# EAGLE design preScale-Mb501 (EAGLE 5.07)
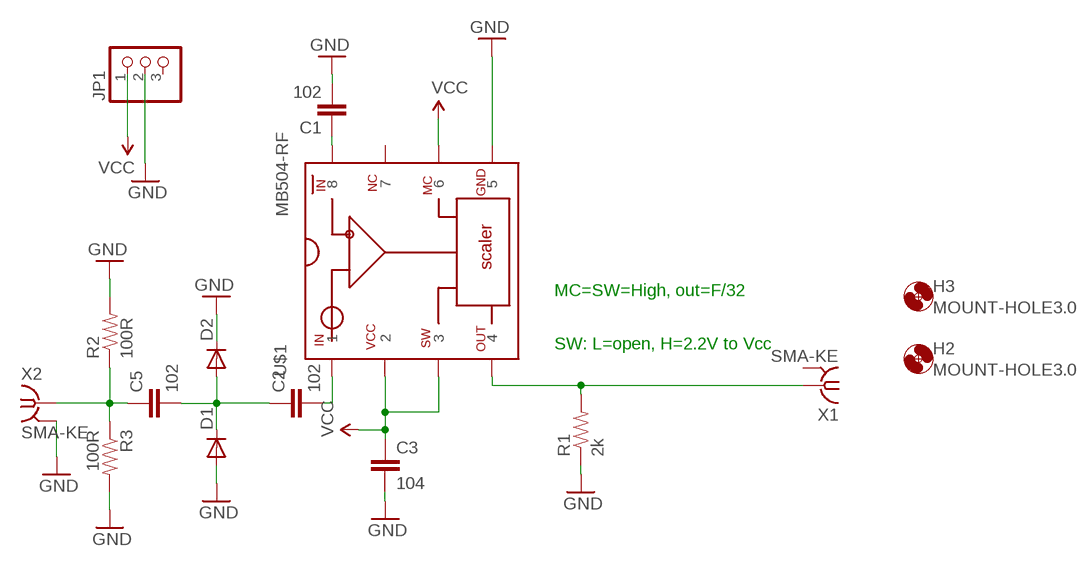
[diagram p0: schematic, sheet 1]

## Parts
C1  102  CAP-C0805  [C0805]
C2  102  CAP-C0805  [C0805]
C3  104  CAP-C0805  [C0805]
C5  102  CAP-C0805  [C0805]
D1  DIODE1206  [1206-DIODE]
D2  DIODE1206  [1206-DIODE]
H2  MOUNT-HOLE3.0  [3,0]
H3  MOUNT-HOLE3.0  [3,0]
JP1  PINHD-1X3PTH  [1X03]
R1  2k  RESISTOR0805  [0805]
R2  100R  RESISTOR0805  [0805]
R3  100R  RESISTOR0805  [0805]
U$1  MB504-RF  [DIP8-RF]
X1  SMA-KE  SMA-142-0711-821/826  [J502-ND-142-0711-821/826]
X2  SMA-KE  SMA-142-0711-821/826  [J502-ND-142-0711-821/826]

## Nets
GND: C1.2 C3.2 D1.A D2.K(C) JP1.2 R1.1 R2.2 R3.2 U$1.P$5 X2.G@1(GND)
N$1: C1.1 U$1.P$8
N$2: C2.2 U$1.P$1
N$3: C2.1 C5.2 D1.K(C) D2.A
N$4: R1.2 U$1.P$4 X1.1
N$5: C5.1 R2.1 R3.1 X2.1
VCC: C3.1 JP1.1 U$1.P$2 U$1.P$3 U$1.P$6
Unconnected: JP1.3 U$1.P$7

## Notes on the sheet
- MC=SW=High, out=F/32
- SW: L=open, H=2.2V to Vcc

## Power pins joined to a net without a drawn wire
GND: X1.G@1(GND) X1.G@2(GND) X1.G@3(GND) X1.G@4(GND) X2.G@2(GND) X2.G@3(GND) X2.G@4(GND)

## Library data of the parts
C1-C3 C5 = digital-toy:CAP: Capacitor Standard 0603 ceramic capacitor, and 0.1" leaded capacitor.
D1 D2 = digital-toy:DIODE: Diode These are standard reverse protection diodes and small signal diodes. SMA package can handle up to about 1A. SOD-323 can handle about 200mA. What the SOD-323 package when ordering, there are some mfgs out there that are 5-pin packages.
H2 H3 = holes:MOUNT-HOLE: MOUNTING HOLE with drill center marker
JP1 = digital-toy:PINHD-1X3: PIN HEADER
R1-R3 = digital-toy:RESISTOR: Resistor Basic schematic elements and footprints for 0603, 1206, and PTH 1/10th watt (small) resistors. digital-toy copy vertical mount of axial-0.3 from rcl.lbr : the 0207/xx
U$1 = dtoy-RF:MB504: MB501/504 by hyl 2011.4.8
X1 X2 = con-coax:SMA-: SMA 50 Ohm End Launch Jack Receptacle - Round Contact Johnson Components Source: www.johnsoncomponents.com .. J502-ND.pdf

## Board
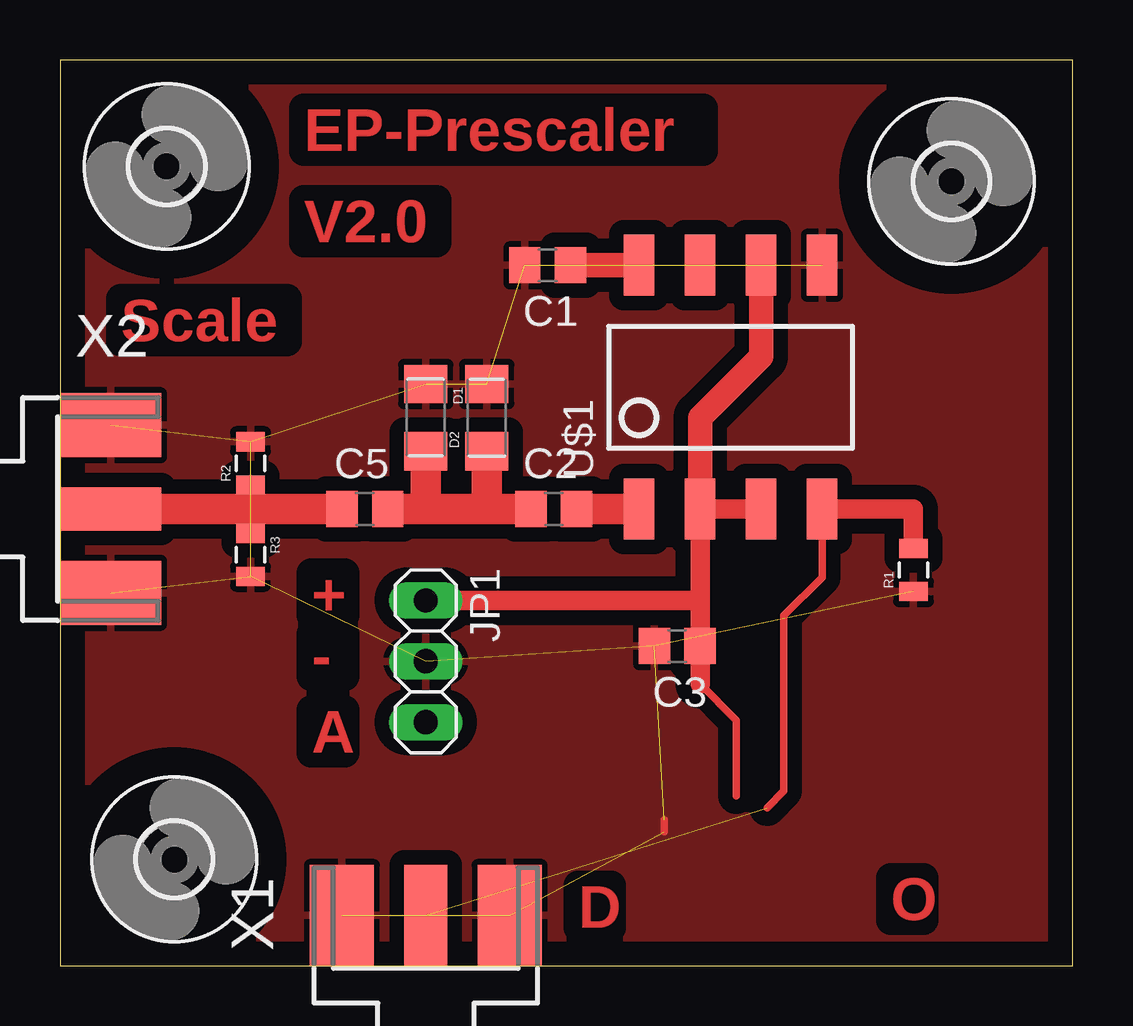
[diagram p1: board, top side]
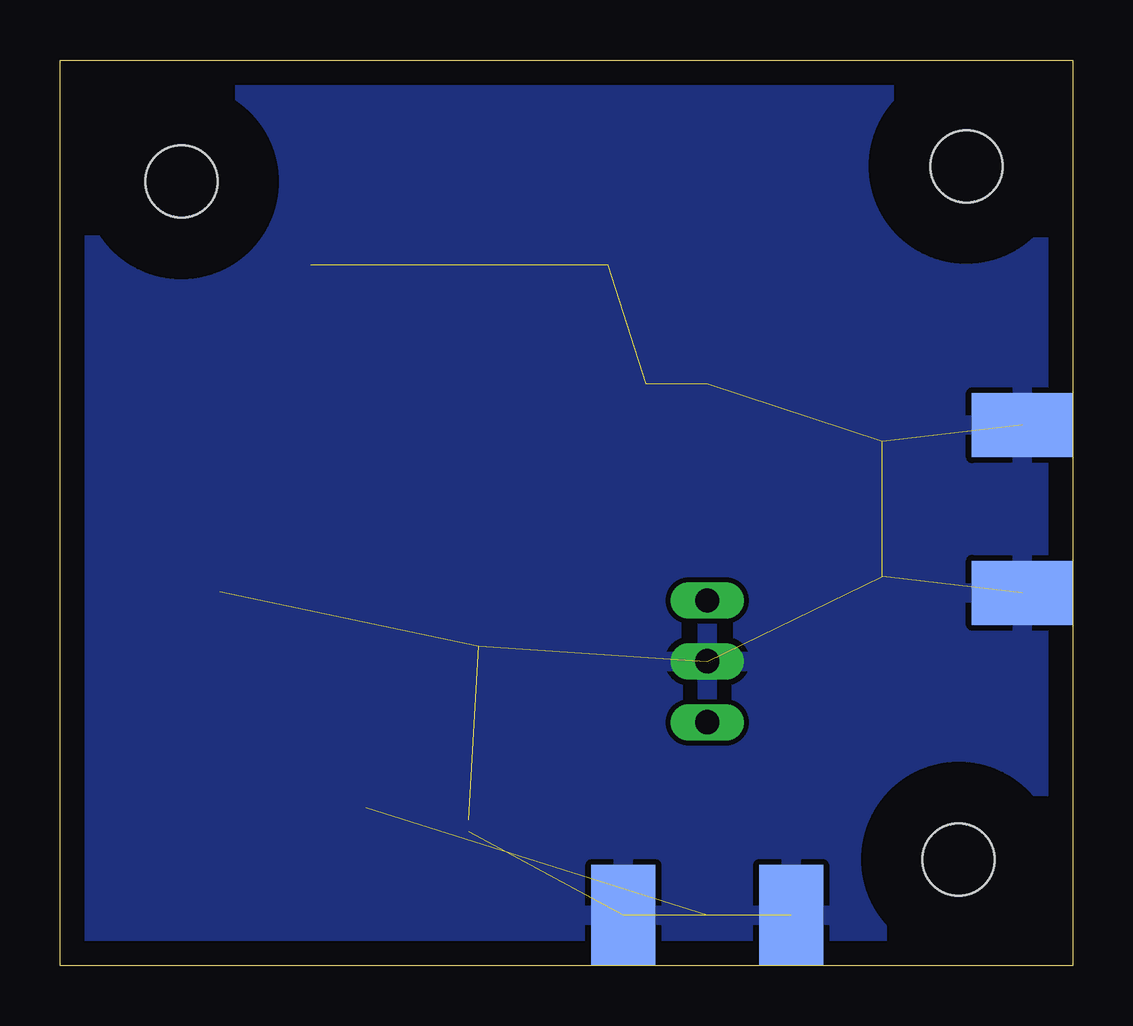
[diagram p2: board, bottom side, seen from below]

Size 42.21 x 37.77 mm. Coordinates in mm from the lower left corner, seen from the top.
Outline: 0,0 42.21,0 42.21,37.77 0,37.77 0,0
Copper layers (1*16): Top 0.035mm / dielectric 1.5mm / Bottom 0.035mm
Design rules "default": minimum track width 10mil, minimum drill 24mil, track to track 8mil, track to pad 8mil, pad to pad 8mil, via to via 8mil, smd to smd 8mil, copper to edge 40mil, drill to drill 8mil, minimum pad ring 10mil, minimum via ring 8mil, stop-mask expansion 4mil, vias tented up to drill 0mil, thermal gap 10mil

### Footprints (pad centres in the part's own frame; a part is rotated, then mirrored left to right if it is on the bottom)
C0805 = smd 1.3 x 1.5: 1 -0.95,0; 2 0.95,0
1206-DIODE = smd 1.6 x 1.8: A -1.4,0; K 1.4,0
3,0 = hole 3: 0,0
1X03 = drill 1.016 long: 1 -2.54,0; 2 0,0; 3 2.54,0
0805 = smd 0.8 x 1.2: 1 -0.9,0; 2 0.9,0
DIP8-RF = smd 1.27 x 2.54: P$1 0,-3.81; P$2 2.54,-3.81; P$3 5.08,-3.81; P$4 7.62,-3.81; P$5 7.62,6.35; P$6 5.08,6.35; P$7 2.54,6.35; P$8 0,6.35
J502-ND-142-0711-821/826 = smd 4.191 x 1.778: 1 2.115,0 | smd 4.191 x 2.667: G@1 2.115,3.495; G@2 2.115,-3.495 | smd 4.191 x 2.667 bottom: G@3 2.115,3.495; G@4 2.115,-3.495

### Placement (x,y rotation side)
C1  20.32,29.21 180 top
C2  20.57,19.05 0 top
C3  25.72,13.34 180 top
C5  12.7,19.05 0 top
D1  15.24,22.86 270 top
D2  17.78,22.86 90 top
H1  MOUNT-HOLE3.0  [3,0]  37.15,32.7 0 top
H2  4.76,4.45 0 top
H3  4.45,33.34 0 top
JP1  15.24,12.7 270 top
R1  35.56,16.51 90 top
R2  7.94,20.95 90 top
R3  7.94,17.14 270 top
U$1  24.13,22.86 0 top
X1  15.24,0 90 top
X2  0,19.05 0 top

### Tracks (layer width: path | path; a pad name or v marks a point on that pad's centre or on a via)
GND  (17 unrouted)
  Top 0.305: 25.17,6.1 25.17,5.6
  pour Top (isolate 0.61): 54.29,47.31 54.61,48.58 56.52,12.38 56.52,-7.94 55.88,-11.43 -11.43,-10.79 -12.06,47.31 0.32,47.94
  pour Bottom: 43.81,40.01 55.88,27.94 55.88,2.22 40.96,-12.7 -16.83,-12.7 -25.08,-4.45 -25.08,27.3 -13.65,38.73 -8.89,38.73
N$1
  Top 1.016: C1.1 U$1.P$8
N$2
  Top 1.27: C2.2 U$1.P$1
N$3
  Top 1.27: C5.2 15.24,19.05 | 15.24,19.05 17.78,19.05 | 17.78,19.05 C2.1 | 15.24,19.05 D1.K | 17.78,19.05 D2.A
N$4  (1 unrouted)
  Top 0.305: 29.46,6.6 30.16,7.3 30.16,14.61 31.75,16.19 U$1.P$4
  Top 0.813: 35.24,19.05 U$1.P$4 35.56,19.05 R1.2
N$5
  Top 0.305: R2.1 7.94,19.05 R3.1
  Top 1.27: X2.1 7.94,19.05 C5.1
VCC
  Top 0.305: 28.17,7.1 28.17,10.25 26.67,11.75
  Top 0.813: 26.67,11.75 C3.1 26.67,15.24 | 26.67,15.24 U$1.P$2 U$1.P$3 | JP1.1 26.67,15.24
  Top 1.016: U$1.P$2 26.67,22.86 29.21,25.4 U$1.P$6

### Text on the board
Top: EP-Prescaler | V2.0 | Scale | + | - | A | D | O